# EAGLE design Esp01Shunt (EAGLE 9.6.2)
Assembly variants: DEFAULT

## Sheet 1 of 3
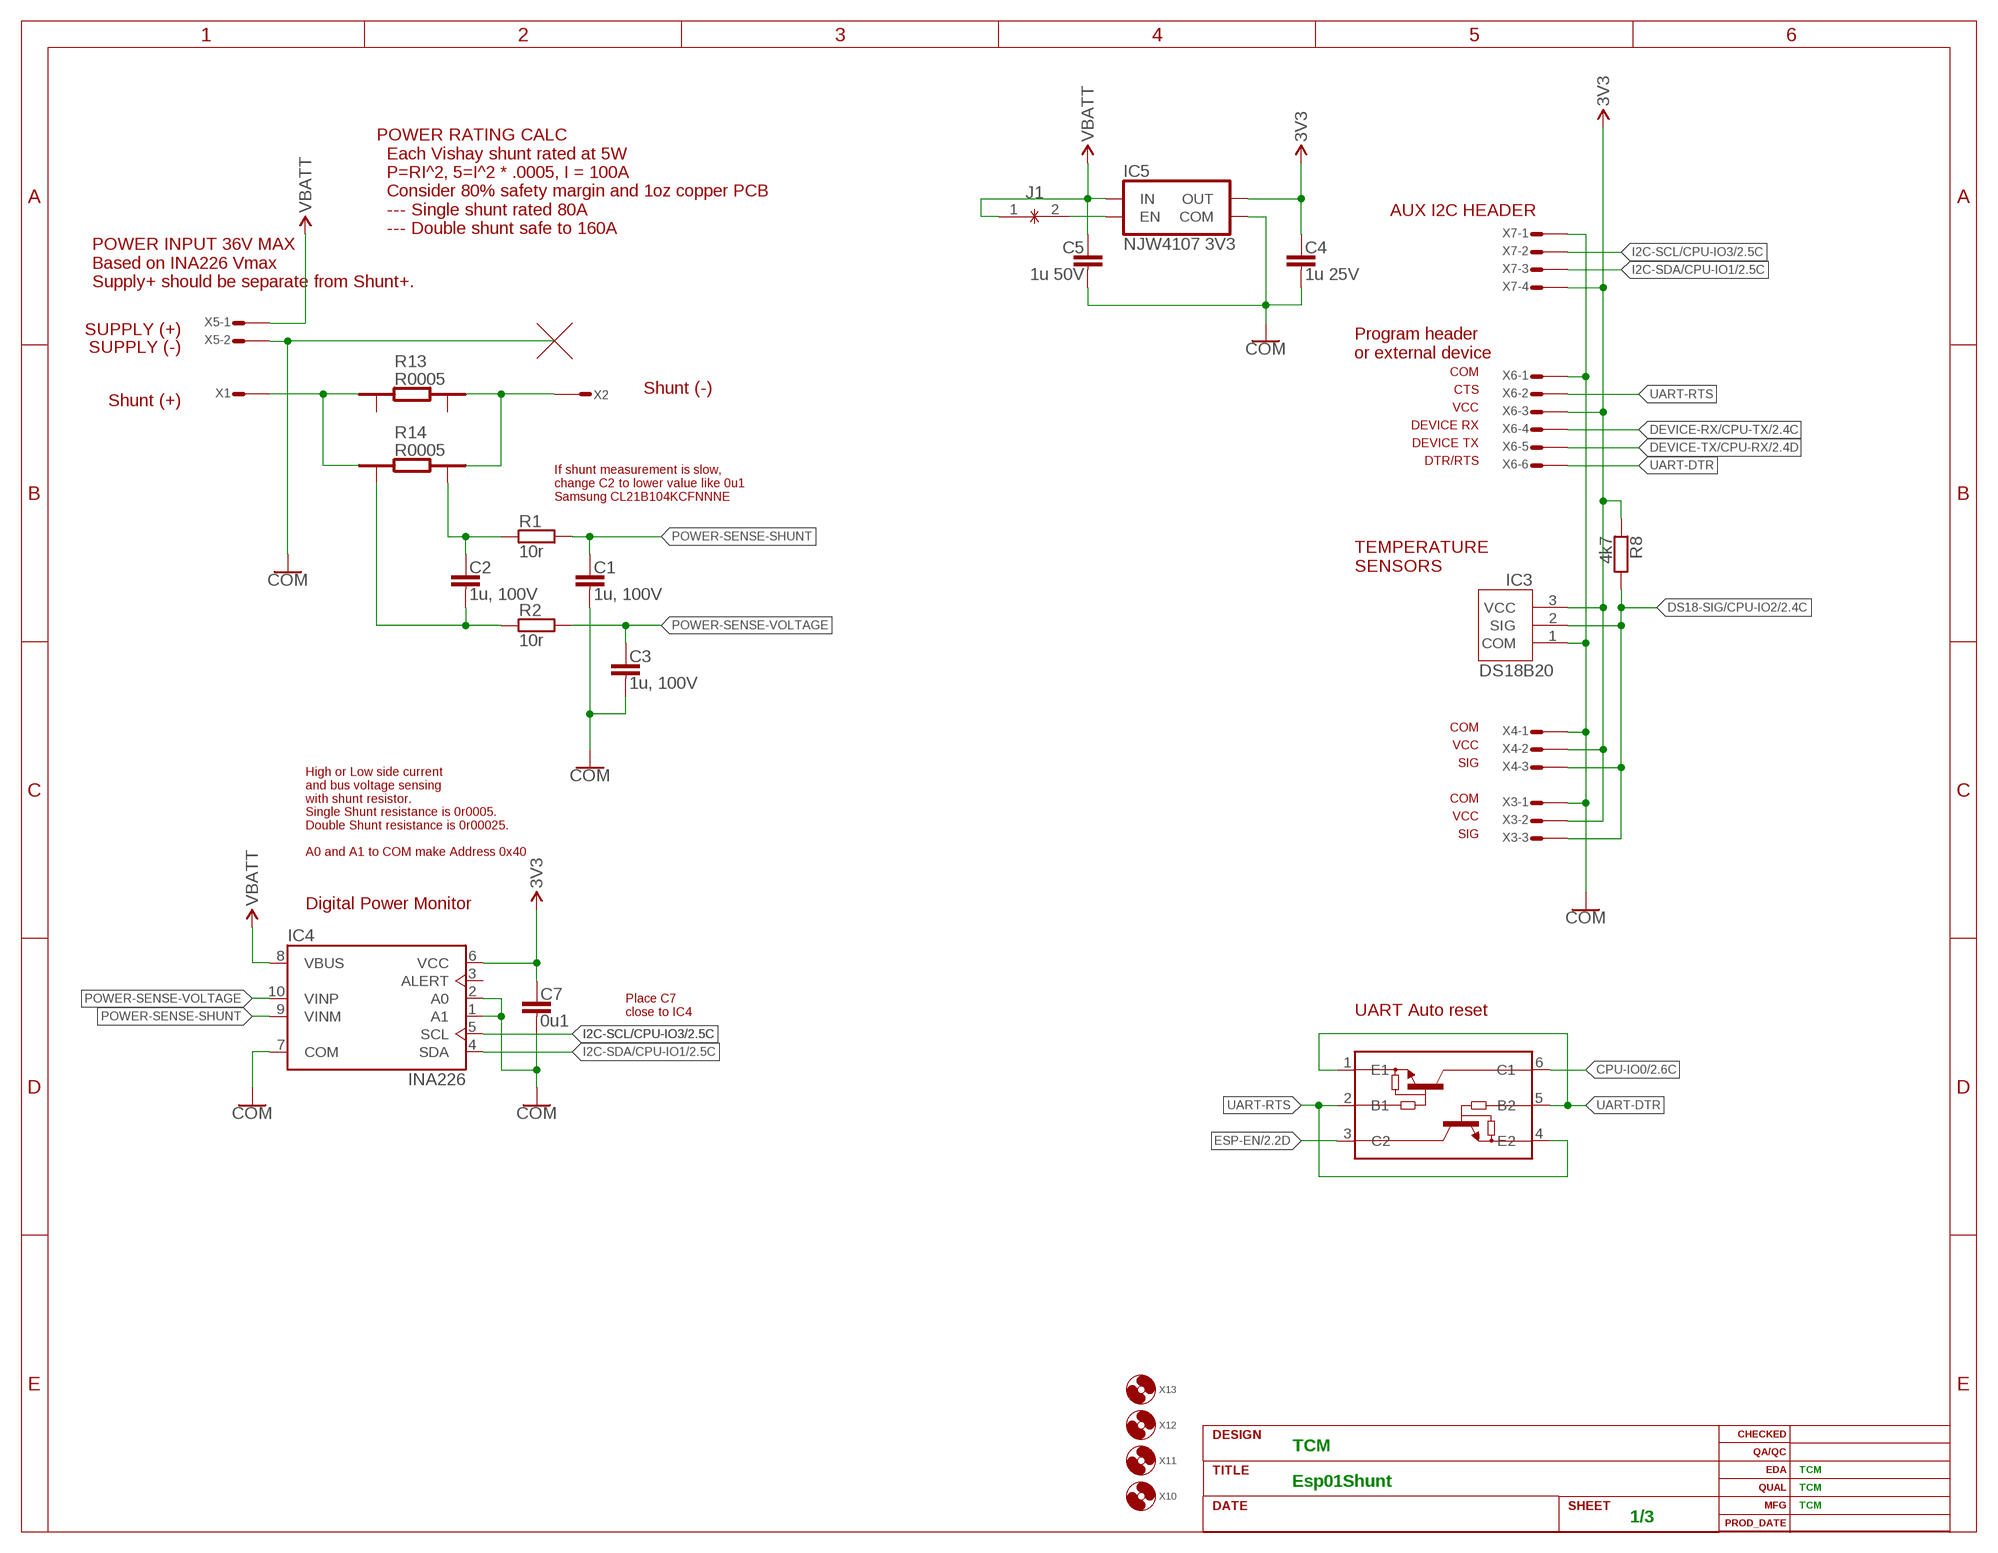
[diagram p0: schematic, sheet 1]
DOC1 (DOC): DESIGNER: TCM; EDA_ENG: TCM; MFG_ENG: TCM; QUAL_ENG: TCM

### Parts
C1  1u, 100V  C-1206  [1206]
C2  1u, 100V  C-1206  [1206]
C3  1u, 100V  C-1206  [1206]
C4  1u 25V  C-0603  [C0603]
C5  1u 50V  C-0603  [C0603]
C7  0u1  C-0603  [C0603]
IC2  MUN5214DW1T1G  MUN5214DW1T1G-TSSOP6  [TSSOP6]
IC3  DS18B20  DS18B20-TO92-INLINE  [TO92-INLINE]  (not fitted in variant DEFAULT)
IC4  INA226  INA226-VSSOP10  [VSSOP10]
IC5  NJW4107 3V3  VREG-WITH-EN-3V3-NJW4107-SOT89-5  [SOT89-5]
J1  JUMPER-60X20-NC  [JUMPER-60X20]  (not fitted in variant DEFAULT)
R1  10r  R-0805  [R0805]
R2  10r  R-0805  [R0805]
R8  4k7  R-0603  [R0603]
R13  R0005  R-SHUNT-4TERM-WSK1216-R0005  [RES-SHUNT-WSK1216]
R14  R0005  R-SHUNT-4TERM-WSK1216-R0005  [RES-SHUNT-WSK1216]
X1  CON-SCREW-V-30AMP  [CON-SCREW-V-30AMP]
X2  CON-SCREW-V-30AMP  [CON-SCREW-V-30AMP]
X3  CON-1X3  [CON-1X3]
X4  CON-1X3  [CON-1X3]
X5  CON-1X2-TERM-SPRING-5MM-2834082-1  [CON-1X2-TERM-SPRING-5MM-2834082-1]
X6  CON-1X6-UART-DCE  [CON-1X6-UART-DCE]
X7  CON-1X4  [CON-1X4]
X10  HOLE-NO-PAD-NO-SILK  [M3-NO-PAD-NO-SILK]  (not fitted in variant DEFAULT)
X11  HOLE-NO-PAD-NO-SILK  [M3-NO-PAD-NO-SILK]  (not fitted in variant DEFAULT)
X12  HOLE-NO-PAD-NO-SILK  [M3-NO-PAD-NO-SILK]  (not fitted in variant DEFAULT)
X13  HOLE-NO-PAD-NO-SILK  [M3-NO-PAD-NO-SILK]  (not fitted in variant DEFAULT)

### Nets
3V3: C4.1 C7.1 IC3.3(VCC) IC4.6(VCC) IC5.4(OUT) R8.1 X3.2 X4.2 X6.3 X7.4 ; also sheet 2
COM: C1.2 C3.2 C4.2 C5.2 C7.2 IC3.1(COM) IC4.1(A1) IC4.2(A0) IC4.7(COM) IC5.2(COM) IC5.5(COM) X3.1 X4.1 X5.3 X5.4 X6.1 X7.1 ; also sheet 2
CPU-IO0: IC2.6(C1) ; also sheet 2
DEVICE-RX/CPU-TX: X6.4 ; also sheet 2
DEVICE-TX/CPU-RX: X6.5 ; also sheet 2
DS18-SIG/CPU-IO2: IC3.2(SIG) R8.2 X3.3 X4.3 ; also sheet 2
ESP-EN: IC2.3(C2) ; also sheet 2
I2C-SCL/CPU-IO3: IC4.5(SCL) X7.2 ; also sheet 2
I2C-SDA/CPU-IO1: IC4.4(SDA) X7.3 ; also sheet 2
N$1 [PWR]: R13.1 R14.1 X1.1(S) X1.2(S) X1.3(S) X1.4(S) X1.5(S) X1.6(S)
N$3: C2.1 R1.+ R14.3
N$4 [PWR]: R13.4 R14.4 X2.1(S) X2.2(S) X2.3(S) X2.4(S) X2.5(S) X2.6(S)
N$5 [PWR]: IC5.1(EN) J1.2
N$6: C2.2 R2.+ R14.2
POWER-SENSE-SHUNT: C1.1 IC4.9(VINM) R1.-
POWER-SENSE-VOLTAGE: C3.1 IC4.10(VINP) R2.-
UART-DTR: IC2.1(E1) IC2.5(B2) X6.6
UART-RTS: IC2.2(B1) IC2.4(E2) X6.2
VBATT [PWR]: C5.1 IC4.8(VBUS) IC5.6(IN) J1.1 X5.1 X5.2
Unconnected: IC4.3(ALERT) R13.2 R13.3

### Notes on the sheet
- AUX I2C HEADER
- POWER RATING CALC
    Each Vishay shunt rated at 5W
    P=RI^2, 5=I^2 * .0005, I = 100A
    Consider 80% safety margin and 1oz copper PCB
    --- Single shunt rated 80A
    --- Double shunt safe to 160A
- POWER INPUT 36V MAX
  Based on INA226 Vmax
  Supply+ should be separate from Shunt+.
- SUPPLY (+)
- SUPPLY (-)
- Program header
  or external device
- COM
- Shunt (+) | Shunt (-) | CTS
- VCC
- DEVICE RX
- DEVICE TX
- DTR/RTS
- If shunt measurement is slow,
  change C2 to lower value like 0u1
  Samsung CL21B104KCFNNNE
- TEMPERATURE
  SENSORS
- COM
- VCC
- SIG
- COM
- VCC
- SIG
- High or Low side current
  and bus voltage sensing
  with shunt resistor.
  Single Shunt resistance is 0r0005.
  Double Shunt resistance is 0r00025.
  
  A0 and A1 to COM make Address 0x40
- Digital Power Monitor
- Place C7
  close to IC4
- UART Auto reset

## Sheet 2 of 3
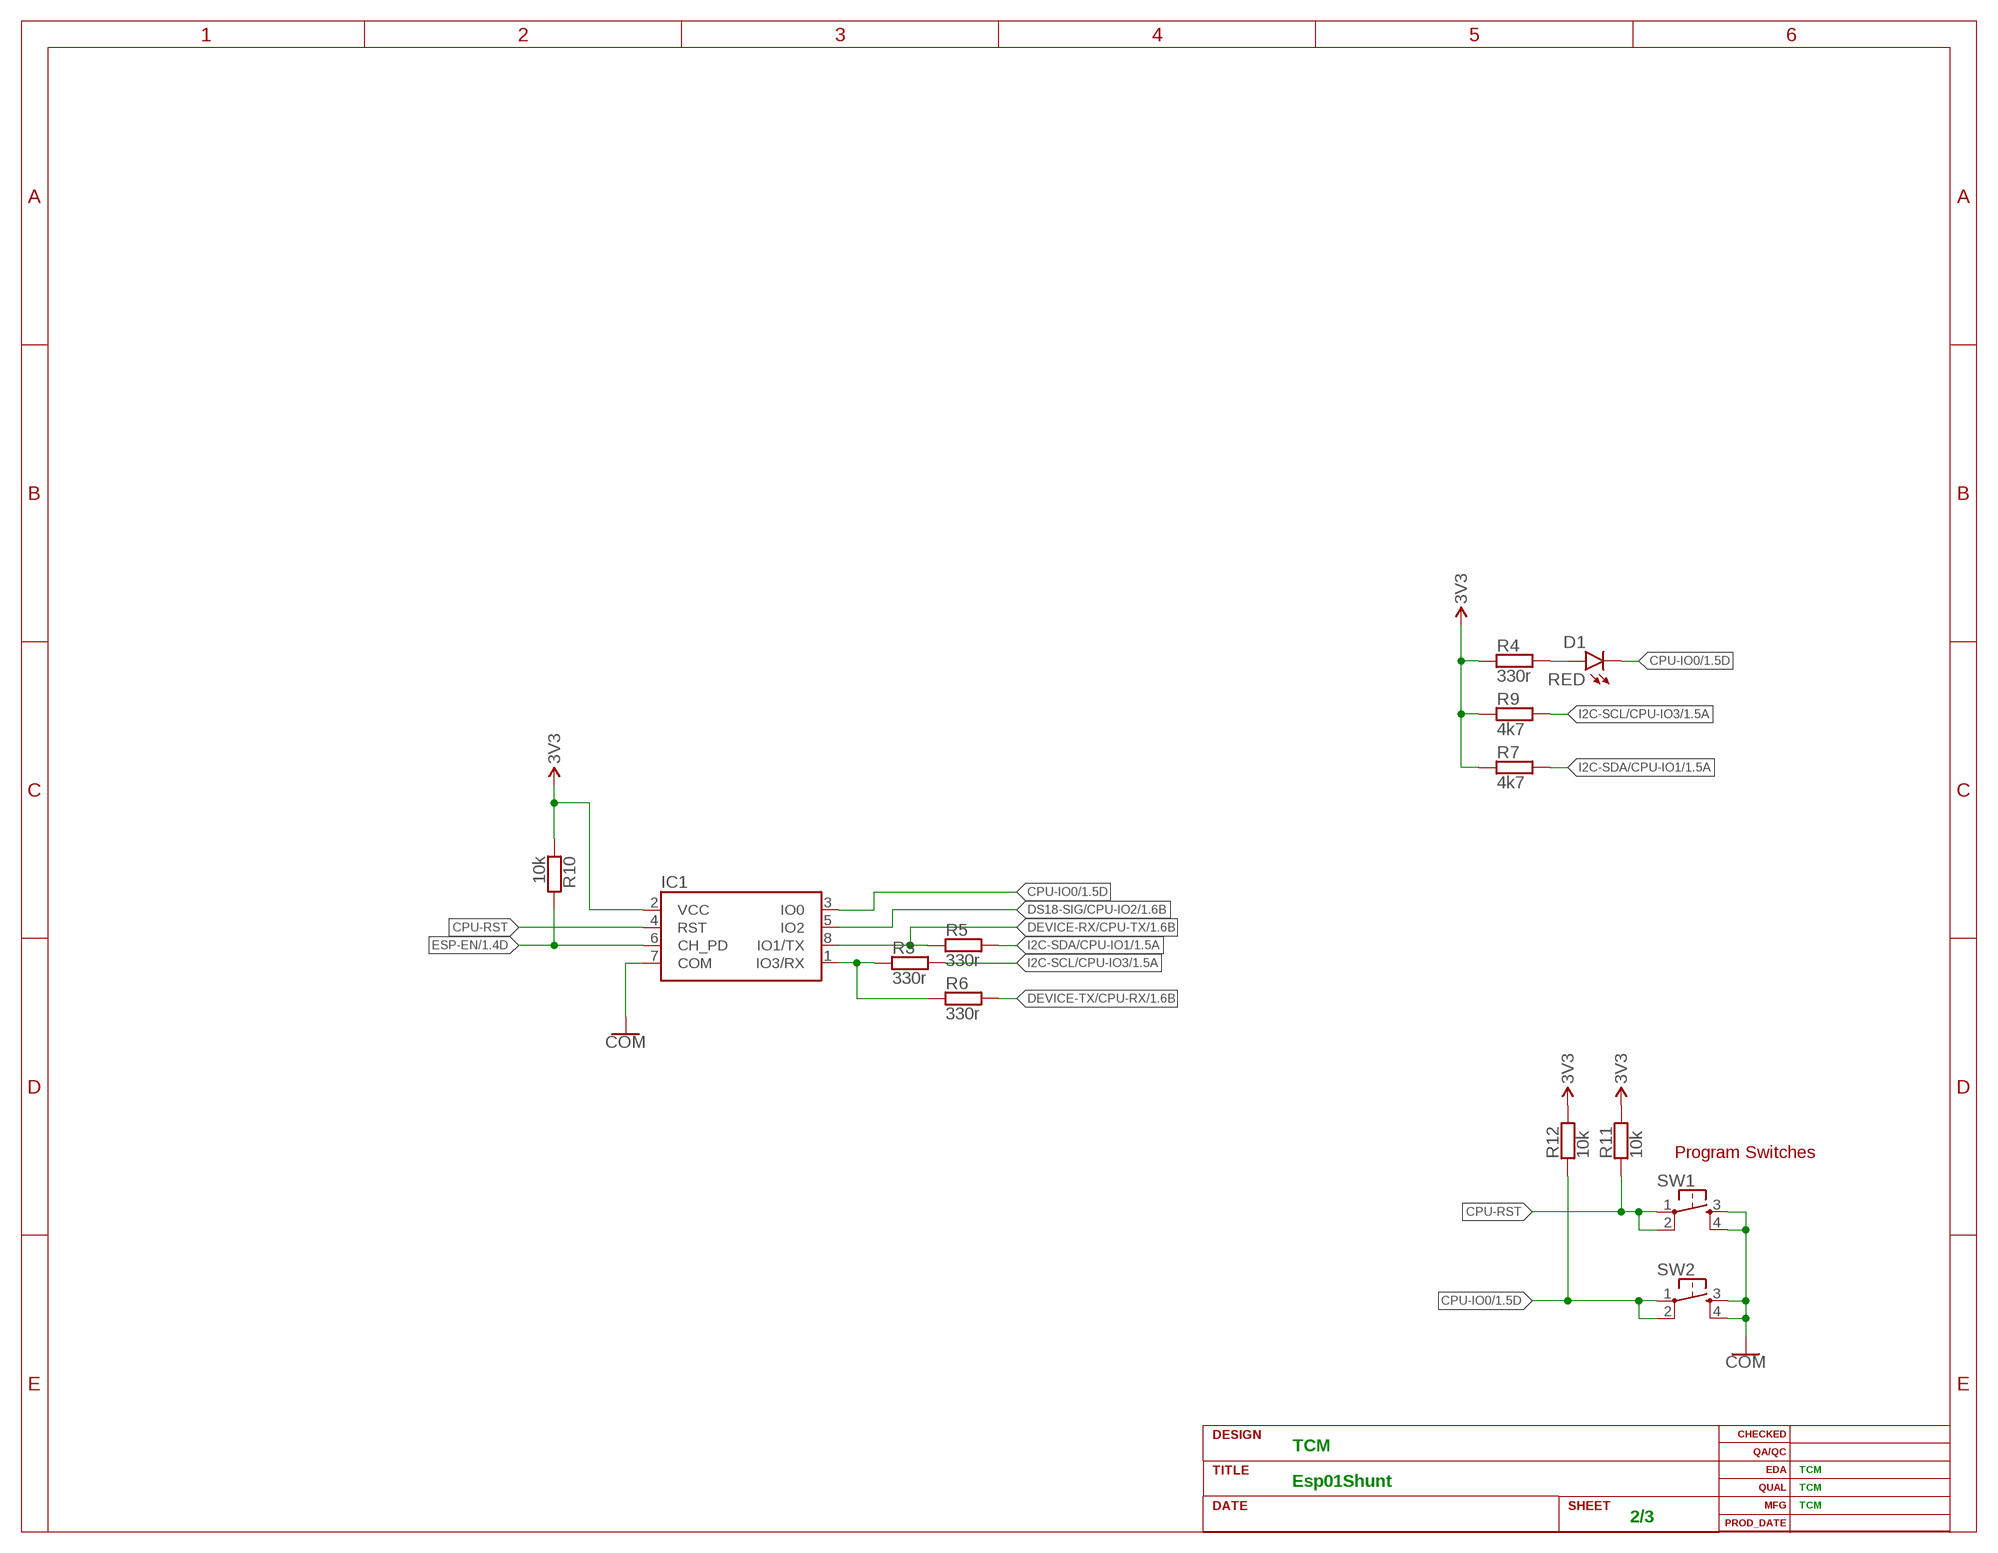
[diagram p1: schematic, sheet 2]
DOC2 (DOC): DESIGNER: TCM; EDA_ENG: TCM; MFG_ENG: TCM; QUAL_ENG: TCM

### Parts
D1  RED  LED-0805-RED  [LED-0805]
IC1  ESP8266-01  [ESP8266-01]
R3  330r  R-0603  [R0603]
R4  330r  R-0603  [R0603]
R5  330r  R-0603  [R0603]
R6  330r  R-0603  [R0603]
R7  4k7  R-0603  [R0603]  (not fitted in variant DEFAULT)
R9  4k7  R-0603  [R0603]  (not fitted in variant DEFAULT)
R10  10k  R-0603  [R0603]
R11  10k  R-0603  [R0603]
R12  10k  R-0603  [R0603]
SW1  SWITCH-TACTILE-DOUBLE-SMD  [SWITCH-TACTILE-6MM-SMD]
SW2  SWITCH-TACTILE-DOUBLE-SMD  [SWITCH-TACTILE-6MM-SMD]

### Nets
3V3: IC1.2(VCC) R4.1 R7.1 R9.1 R10.1 R11.2 R12.2 ; also sheet 1
COM: IC1.7(COM) SW1.3 SW1.4 SW2.3 SW2.4 ; also sheet 1
CPU-IO0: D1.-(C) IC1.3(IO0) R12.1 SW2.1 SW2.2 ; also sheet 1
CPU-RST: IC1.4(RST) R11.1 SW1.1 SW1.2
DEVICE-RX/CPU-TX: IC1.8(IO1/TX) R5.1 ; also sheet 1
DEVICE-TX/CPU-RX: R6.2 ; also sheet 1
DS18-SIG/CPU-IO2: IC1.5(IO2) ; also sheet 1
ESP-EN: IC1.6(CH_PD) R10.2 ; also sheet 1
I2C-SCL/CPU-IO3: R3.2 R9.2 ; also sheet 1
I2C-SDA/CPU-IO1: R5.2 R7.2 ; also sheet 1
N$2: IC1.1(IO3/RX) R3.1 R6.1
N$8: D1.+(A) R4.2

### Notes on the sheet
- Program Switches

## Sheet 3 of 3
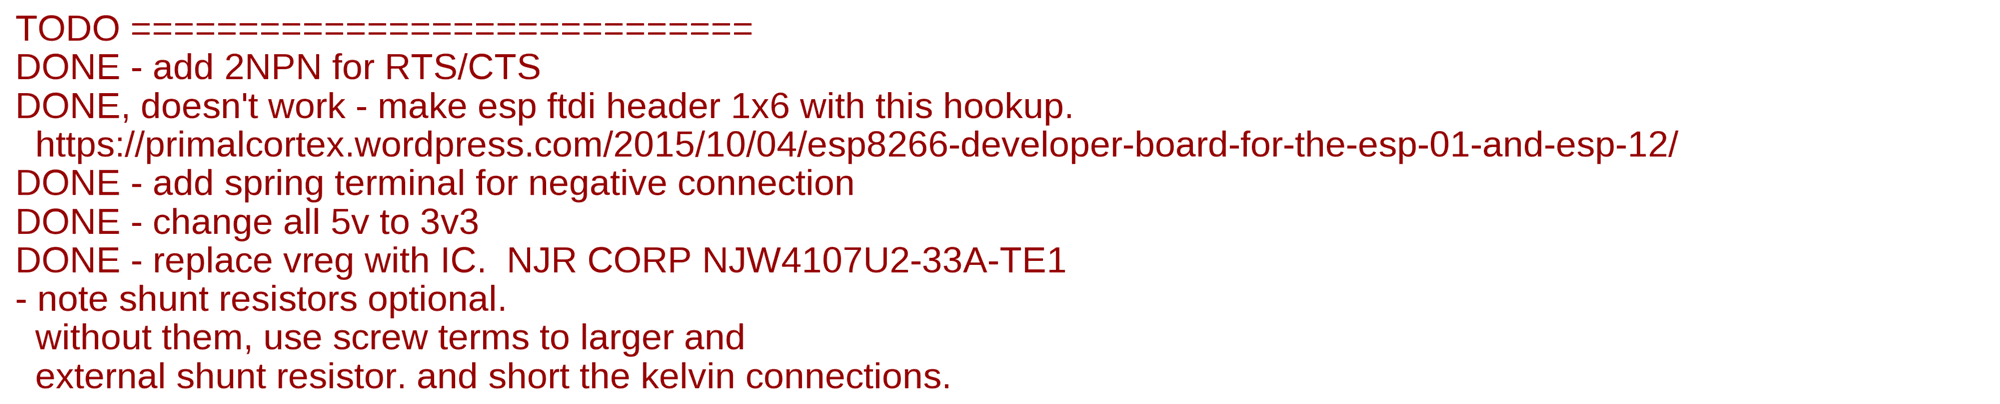
[diagram p2: schematic, sheet 3]

### Notes on the sheet
- TODO =============================
  DONE - add 2NPN for RTS/CTS
  DONE, doesn't work - make esp ftdi header 1x6 with this hookup. 
    https://primalcortex.wordpress.com/2015/10/04/esp8266-developer-board-for-the-esp-01-and-esp-12/
  DONE - add spring terminal for negative connection
  DONE - change all 5v to 3v3
  DONE - replace vreg with IC.  NJR CORP NJW4107U2-33A-TE1
  - note shunt resistors optional. 
    without them, use screw terms to larger and
    external shunt resistor. and short the kelvin connections.

## Library data of the parts
C1-C3 = lumisense:C: Capacitors; MFG: SAMSUNG; MFG_PN: CL31B105KCHNNNE
C4 = lumisense:C: Capacitors; MFG_PN: C1608X7R1E105K080AE
C5 = lumisense:C: Capacitors; MFG_PN: C1608X5R1H105K080AB
C7 = lumisense:C: Capacitors; MFG_PN: VJ0603Y104JXXAC
D1 = lumisense:LED: LED; MFG: OSRAM; MFG_PN: LS R976-NR-1; SUPP: DIGIKEY; SUPP_PN: 475-1278-1-ND
IC1 = lumisense:ESP8266-01: ESP8266-01; MFG: ESPRESSIF; MFG_PN: ESP8266-01; SUPP: EBAY; SUPP_PN: 271676213483
IC2 = lumisense:MUN5214: BJT 2NPN PREBIAS 0.25W; MFG: ONSEMI; MFG_PN: MUN5214DW1T1G; SUPP: DIGIKEY; SUPP_PN: MUN5214DW1T1GOSCT-ND
IC3 = lumisense:DS18B20: DS18B20 One-Wire Digital Thermometer -TO92 is Sparkfun SEN-00245
IC4 = lumisense:INA226: Texas INA226 Power monitor, I2C, 36V 36V, 16-bit, ultra-precise i2c output current/voltage/power monitor w/alert; MFG: TEXAS; MFG_PN: INA226AIDGS
IC5 = lumisense:VREG-WITH-EN: VOLTAGE REGULATOR; MFG: NJR CORP; MFG_PN: NJW4107U2-33A-TE1; SUPP: DIGIKEY; SUPP_PN: 190-NJW4107U2-33A-TE1CT-ND
J1 = lumisense:JUMPER: JUMPER Use to connect two signals at a single point. Cut the jumper on-board if needed.
R1 R2 = lumisense:R: Resistors
R3-R6 = lumisense:R: Resistors; MFG_PN: ERJ-3EKF3300V
R7-R9 = lumisense:R: Resistors; MFG_PN: ERJ-3GEYJ472V
R10-R12 = lumisense:R: Resistors; MFG_PN: ERJ-3GEYJ103V
R13 R14 = lumisense:R-SHUNT-4TERM: Shunt resistor with Kelvin connection; MFG: VISHAY; MFG_PN: WSK1216L5000FEA
SW1 SW2 = lumisense:SWITCH-TACTILE-DOUBLE: SWITCH, TACTILE; MFG: C&K; MFG_PN: PTS645SK50SMTR92 LFS; SUPP: DIGIKEY; SUPP_PN: CKN9087CT-ND
X1 X2 = lumisense:CON-SCREW: SCREW TERMINAL COLOR SELECTION: Select desired screw terminal and add suffix to the Cat. No. HEAD COLOR SUFFIX RED -2 BLACK -3 WHITE -4 BLUE -5 GREEN -6 YELLOW -7 NICKEL no suffix; MFG: KEYSTONE; MFG_PN: 8197; SUPP: DIGIKEY; SUPP_PN: 36-8197-ND
X3 X4 = lumisense:CON-1X3: Connector, 3 pos
X5 = lumisense:CON-1X2: Connector, 2 pos; MFG: TE CONN; MFG_PN: 2834082-1; SUPP: DIGIKEY; SUPP_PN: A124223-ND
X6 = lumisense:CON-1X6: Connector, 6 pos
X7 = lumisense:CON-1X4: Connector, 4 pos
X10-X13 = Lumisense:HOLE-NO-PAD: HOLE, NO PAD

## Net classes
1 PWR: width 0.3 mm, clearance 0.2 mm

## Board
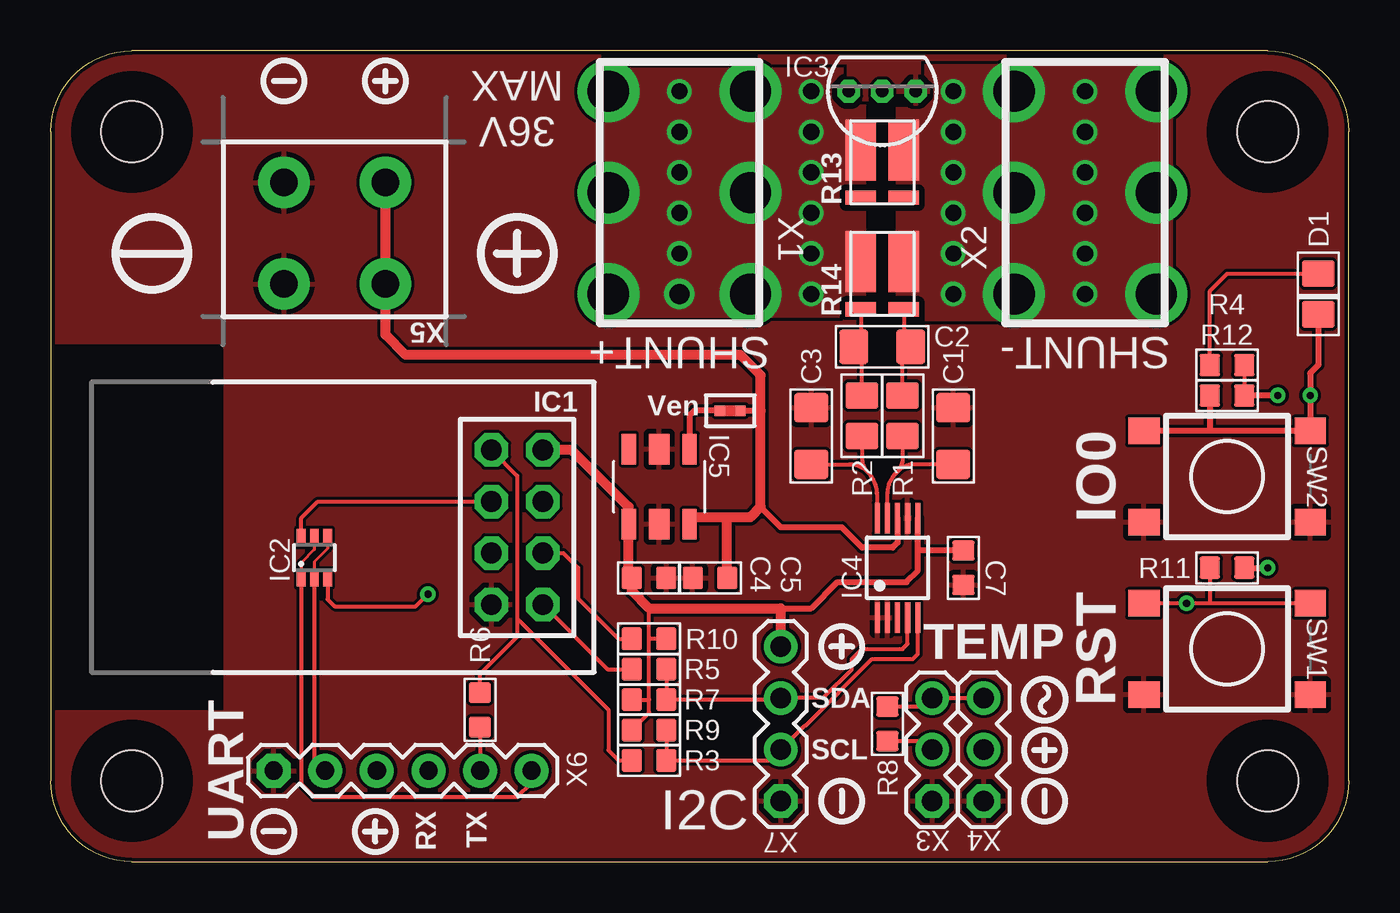
[diagram p3: board, top side]
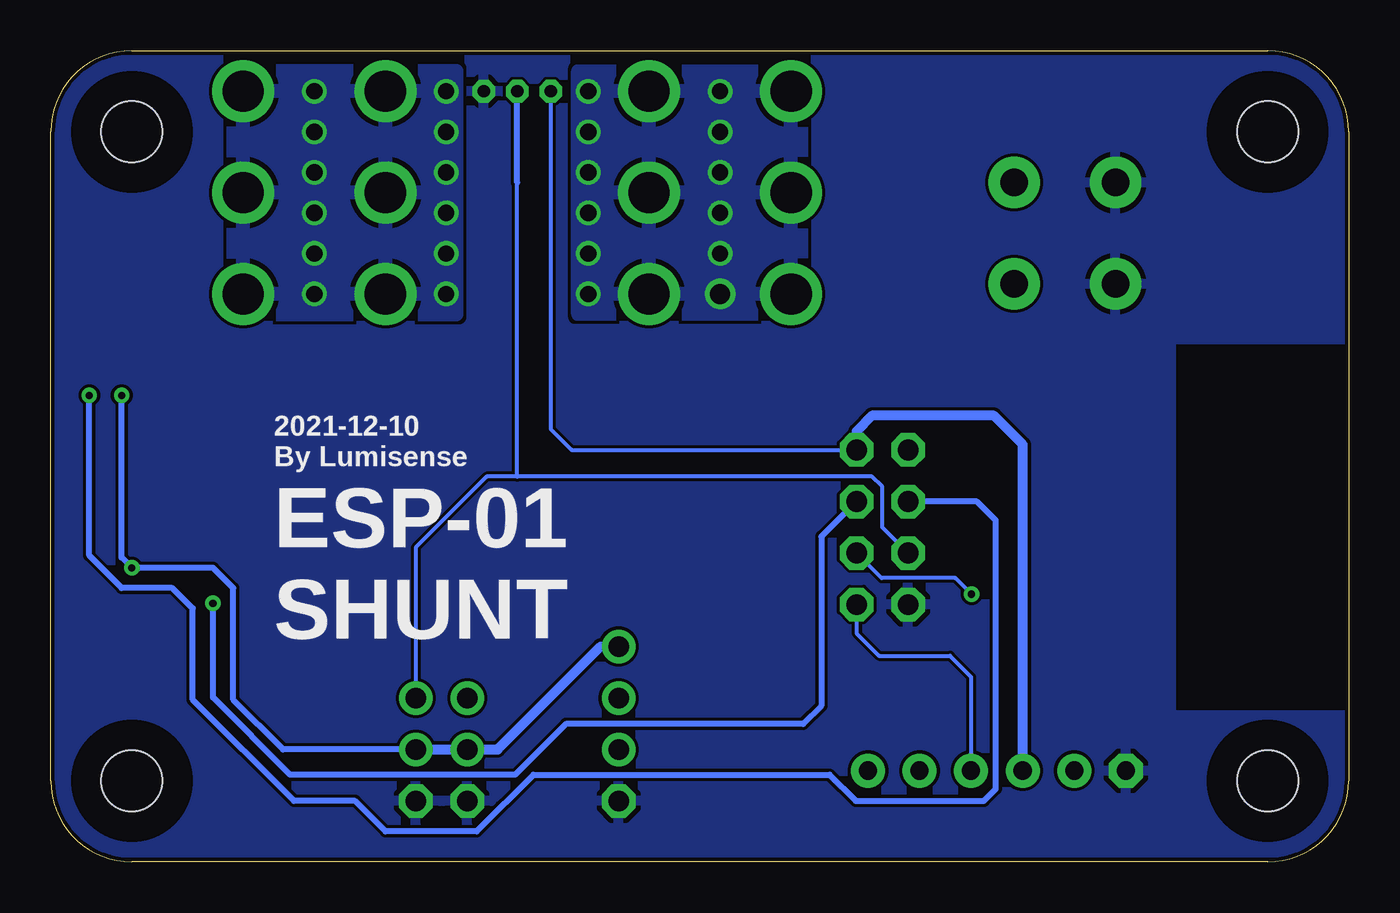
[diagram p4: board, bottom side, seen from below]

Size 64 x 40 mm. Coordinates in mm from the lower left corner, seen from the top.
Outline: 4,0 60,0 arc90 64,4 64,36 arc90 60,40 4,40 arc90 0,36 0,4 arc90 4,0
Copper layers (1*16): Top 0.035mm / dielectric 1.52mm / Bottom 0.035mm
Design rules "Lumisense_2Layer_1.6mm_DRU": minimum track width 6mil, minimum drill 0.3mm, track to track 6mil, track to pad 6mil, pad to pad 6mil, via to via 6mil, smd to smd 0mil, copper to edge 8mil, drill to drill 16mil, minimum pad ring 10mil, minimum via ring 8mil, stop-mask expansion 4mil, vias tented up to drill 40mil, thermal gap 10mil
tRestrict: area 0,7.5 to 8.5,25.5
bRestrict: area 0,7.5 to 8.5,25.5

### Footprints (pad centres in the part's own frame; a part is rotated, then mirrored left to right if it is on the bottom)
1206 = smd 1.422 x 1.676: 1 -1.4,0; 2 1.4,0
C0603 = smd 1 x 1.1: 1 -0.85,0; 2 0.85,0
LED-0805 = smd 1.3 x 1.6: + -1,0; - 1,0
ESP8266-01 = drill 1.016 pad 1.651 octagon: 1 -3.81,-1.27; 2 -3.81,1.27; 3 -1.27,-1.27; 4 -1.27,1.27; 5 1.27,-1.27; 6 1.27,1.27; 7 3.81,-1.27; 8 3.81,1.27
TSSOP6 = smd 0.43 x 0.85: 1 -0.65,-1; 2 0,-1; 3 0.65,-1; 4 0.65,1; 5 0,1; 6 -0.65,1
TO92-INLINE = drill 0.61 octagon: 1 1.651,0; 2 0,0; 3 -1.651,0
VSSOP10 = smd 1.5 x 0.25: 1 -2.45,1; 2 -2.45,0.5; 3 -2.45,0; 4 -2.45,-0.5; 5 -2.45,-1; 6 2.45,-1; 7 2.45,-0.5; 8 2.45,0; 9 2.45,0.5; 10 2.45,1
SOT89-5 = smd 0.7 x 1.5: 1 -1.5,-1.85; 3 1.5,-1.85; 4 1.5,1.85; 6 -1.5,1.85 | smd 1 x 1.5: 2 0,-1.85; 5 0,1.85
JUMPER-60X20 = smd 0.508 x 0.508: 1 -0.508,0; 2 0.508,0
R0805 = smd 1.3 x 1.6: + -1,0; - 1,0
R0603 = smd 1 x 1.1: 1 -0.85,0; 2 0.85,0
RES-SHUNT-WSK1216 = smd 3 x 1.5: 1 0.6,1.055; 4 0.6,-1.055 | smd 0.7 x 1.5: 2 -1.75,1.055; 3 -1.75,-1.055
SWITCH-TACTILE-6MM-SMD = smd 1.55 x 1.3: 1 -4.1,2.25; 2 4.1,2.25; 3 -4.1,-2.25; 4 4.1,-2.25
CON-SCREW-V-30AMP = drill 2.032: 1 -5.004,3.505; 2 0,3.505; 3 5.004,3.505; 4 -5.004,-3.505; 5 0,-3.505; 6 5.004,-3.505
CON-1X3 = drill 1.016 pad 1.651 octagon: 1 0,0 | drill 1.016 pad 1.651: 2 2.54,0; 3 5.08,0
CON-1X2-TERM-SPRING-5MM-2834082-1 = drill 1.35 pad 2.54: 1 0,5; 2 0,0; 3 5,5; 4 5,0
CON-1X6-UART-DCE = drill 0.889 pad 1.676 octagon: 1 0,0 | drill 0.889 pad 1.676: 2 2.54,0; 3 5.08,0; 4 7.62,0; 5 10.16,0; 6 12.7,0
CON-1X4 = drill 1.016 pad 1.651 octagon: 1 0,0 | drill 1.016 pad 1.651: 2 2.54,0; 3 5.08,0; 4 7.62,0
M3-NO-PAD-NO-SILK = hole 3: 0,0

### Placement (x,y rotation side)
C1  44.5,21 90 top
C2  41,25.4 180 top
C3  37.5,21 90 top
C4  29.5,14 0 top
C5  32.5,14 180 top
C7  45,14.5 270 top
D1  62.5,28 270 top
IC1  23,16.5 270 top
IC2  13,15 0 top
IC3  41,38 0 top
IC4  41.75,14.5 90 top
IC5  30,18.5 180 top
J1  33.5,22.25 180 top
R1  42,22 270 top
R2  40,22 270 top
R3  29.5,5 0 top
R4  58,24.5 180 top
R5  29.5,9.5 0 top
R6  21.16,7.5 270 top
R7  29.5,8 0 top
R8  41.25,6.81 90 top
R9  29.5,6.5 0 top
R10  29.5,11 180 top
R11  58,14.5 0 top
R12  58,23 0 top
R13  41,34.5 90 top
R14  41,29 90 top
SW1  58,10.5 0 top
SW2  58,19 0 top
U$1  [SYMBOL-PLUS-SILK]  23,30 0 top
U$2  [SYMBOL-MINUS-SILK]  5,30 0 top
U$3  [SYMBOL-MINUS-SILK-1MM]  39,3 270 top
U$4  [SYMBOL-MINUS-SILK-1MM]  11.5,38.5 180 top
U$5  [SYMBOL-PLUS-SILK-1MM]  16.5,38.5 180 top
U$8  [SYMBOL-TILDE-SILK-1MM]  49,8 270 top
U$9  [SYMBOL-PLUS-SILK-1MM]  49,5.5 270 top
U$10  [SYMBOL-MINUS-SILK-1MM]  11,1.5 180 top
U$11  [SYMBOL-PLUS-SILK-1MM]  16,1.5 90 top
U$12  [SYMBOL-MINUS-SILK-1MM]  49,3 270 top
U$17  [SYMBOL-PLUS-SILK-1MM]  39,10.62 180 top
X1  31,33 90 top
X2  51,33 270 top
X3  43.46,3 90 top
X4  46,3 90 top
X5  16.5,33.5 180 top
X6  11,4.5 0 top
X7  36,3 90 top
X10  60,4 180 top
X11  60,36 270 top
X12  4,36 0 top
X13  4,4 90 top

### Tracks (layer width: path | path; a pad name or v marks a point on that pad's centre or on a via)
3V3  (via drill 0.35)
  Top 0.2: R9.1 29.5,7.35 29.5,8 | 29.5,8 29.5,11 | 29.5,11 29.5,12.5 | R10.1 29.5,11 | R7.1 29.5,8 | R4.1 R12.2 | R8.1 43.04,5.96 X3.2
  Top 0.3: 36,12.5 37.5,12.5 38.8,13.8 42.2,13.8 42.75,14.35 42.75,15.35 | v60.5,23 R12.2 | R11.2 v60,14.5 | 42.75,15.35 IC4.6 | C7.1 42.75,15.35
  Top 0.5: IC1.2 25.69,20.31 28.5,17.5 IC5.4 28.5,14.15 C4.1 28.65,13.35 29.5,12.5 36,12.5 X7.4
  Bottom 0.2: IC3.3 39.35,21.35 38.31,20.31 IC1.2
  Bottom 0.3: X4.2 52.54,5.54 55,8 55,13.5 56,14.5 v60,14.5 60.5,15 v60.5,23
  Bottom 0.5: X6.3 16.08,20.58 17.5,22 23.5,22 24.27,21.23 IC1.2 | X4.2 X3.2 41.96,5.54 36.88,10.62 X7.4
COM
  pour Bottom (rank 6): 0,0 64,0 64,40 0,40
  pour Top (rank 6): 64,0 0,0 0,40 64,40
CPU-IO0  (via drill 0.35)
  Top 0.2: IC2.6 12.35,16.95 13.17,17.77 IC1.3
  Top 0.3: 57.15,21.25 SW2.2 v62.1,23 62.1,24.1 62.5,24.5 D1.- | 57.15,21.25 SW2.1 | R12.1 57.15,21.25
  Bottom 0.3: v62.1,23 62.1,15.1 60.5,13.5 58,13.5 57,12.5 57,8 52,3 49,3 47.5,1.5 43,1.5 40.2,4.3 25.6,4.3 24.3,3 18,3 17.4,3.6 17.4,16.84 18.33,17.77 IC1.3
CPU-RST  (via drill 0.35)
  Top 0.2: SW1.1 v56,12.75 57.15,12.75 | SW1.2 57.15,12.75 | R11.1 57.15,12.75
  Bottom 0.3: IC1.4 26,16.04 26,7.7 26.9,6.8 38.6,6.8 41.1,4.3 52.2,4.3 56,8.1 v56,12.75
DEVICE-RX/CPU-TX
  Top 0.2: IC1.8 27.46,9.5 R5.1
  Bottom 0.2: IC1.8 24.27,11.27 23.16,10.16 19.66,10.16 18.62,9.12 X6.4
DEVICE-TX/CPU-RX
  Top 0.2: R6.2 X6.5
DS18-SIG/CPU-IO2
  Top 0.2: R8.2 43.04,7.66 X3.3 X4.3
  Bottom 0.2: 41,19 41,33.5 | IC1.5 23,16.5 23,18.5 23.5,19 41,19 | 41,19 42.5,19 46,15.5 X4.3
  Bottom 0.3: 41,33.5 IC3.2
ESP-EN  (via drill 0.35)
  Top 0.2: IC1.6 25.27,15.23 26,14.5 26,13 28,11 R10.2 | IC2.3 13.65,12.95 14,12.6 18,12.6 v18.6,13.2
  Bottom 0.2: v18.6,13.2 19.4,14 23.04,14 IC1.6
I2C-SCL/CPU-IO3
  Top 0.2: R9.2 R3.2 35.46,5 X7.2 37.19,6.73 37.23,6.73 40.5,10 42.5,10 42.75,10.25 IC4.5
I2C-SDA/CPU-IO1
  Top 0.2: R5.2 R7.2 35.92,8 X7.3 38.08,8.08 39.5,9.5 39.5,10 40,10.5 42,10.5 42.25,10.75 IC4.4
N$1  (via drill 0.8, 1)
  other vias: 31,28 31,30 31,32 31,34 31,36 31,38 37.5,38 37.5,36 37.5,34 37.5,32 37.5,30 37.5,28
  pour Bottom (isolate 0.3): 38,39 27,39 27,27 38,27
  pour Top (isolate 0.3, no thermals): 27.5,39 40,39 40,27 27.5,27
N$2
  Top 0.2: IC1.1 23,19.04 23,12 | 23,12 27.5,7.5 27.5,5.5 28,5 R3.1 | 23,12 23,11.1 21.16,9.26 R6.1
N$3
  Top 0.2: R1.+ 42,25 C2.1 42.05,25.75 R14.3
N$4  (via drill 0.8)
  other vias: 44.5,38 44.5,36 44.5,34 44.5,32 44.5,30 44.5,28 51,38 51,36 51,34 51,32 51,30 51,28
  pour Top (isolate 0.3, no thermals): 55,39 42,39 42,27 55,27
  pour Bottom (isolate 0.3): 44,39 55,39 55,27 44,27
N$5
  Top 0.3: J1.2 31.75,22.25 31.5,22 IC5.1
N$6
  Top 0.2: R2.+ 40,25 C2.2 39.95,25.75 R14.2
N$8
  Top 0.2: R4.2 57.15,28.15 58,29 D1.+
POWER-SENSE-SHUNT
  Top 0.2: IC4.9 41.25,18.05 arc-45 41.7,19.2 | C1.1 42.6,19.6 arc50 41.7,19.2 | 41.7,19.2 arc42 42,19.8 R1.-
POWER-SENSE-VOLTAGE
  Top 0.2: IC4.10 40.75,18.05 arc45 40.3,19.2 | C3.1 39.4,19.6 arc-50 40.3,19.2 | 40.3,19.2 arc-42 40,19.8 R2.-
UART-DTR
  Top 0.152: IC2.5 13,15.4 12.35,14.75 IC2.1
  Top 0.2: IC2.1 12.35,3.85 13,3.2 23,3.2 23.7,3.9 X6.6
UART-RTS
  Top 0.152: IC2.4 13.65,15.45 13,14.8 IC2.2
  Top 0.2: X6.2 13,5.04 IC2.2
VBATT
  Top 0.3: 31.84,16.99 IC5.6 | J1.1 35,22.25 | IC4.8 41.75,15.75 41.5,15.5 40,15.5 39,16.5 36,16.5 35,17.5
  Top 0.5: 33.35,16.99 34.49,16.99 35,17.5 35,22.25 35,24 34,25 17.5,25 16.5,26 X5.1 X5.2 | 33.35,16.99 31.84,16.99 | C5.1 33.35,16.99

### Text on the board
tPlace: 36V / MAX | SHUNT+ | SHUNT- | Ven | IO0 | TEMP | RST | SDA | SCL | UART | RX | TX | I2C
bPlace: 2021-12-10 / By Lumisense | ESP-01 / SHUNT